# Altium schematic sheet Sensor_ExpandBoard_BH1750FV.SchDoc: Sensor Card
size A4; Revision: V1.1; SheetNumber: 6; SheetTotal: 7; Function: Ambient Light Sensor
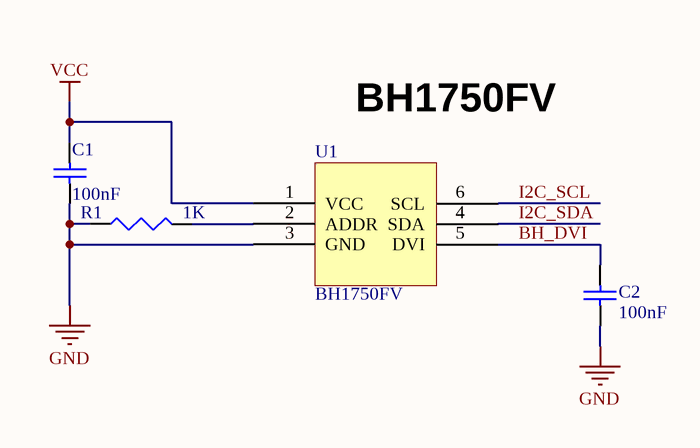
[diagram p0: Sensor_ExpandBoard_BH1750FV.SchDoc]

## Parts
C1  100nF  [0603-2]
C2  100nF  [0603-2]
R1  1K  [R0603]
U1  BH1750FV  [WSOF6]

## Nets
GND: C1.2 C2.2 R1.1 U1.3(GND)
VCC: C1.1 U1.1(VCC)
BH_DVI: C2.1 U1.5(DVI)
I2C_SCL: U1.6(SCL)
I2C_SDA: U1.4(SDA)
NetR1_2: R1.2 U1.2(ADDR)

## Notes on the sheet
- BH1750FV
- 工程名称：
- 图纸大小：
- 日期：
- A4
- 版本号：
- 页码：
- 第
- 共
- 制图：
- 审核：

## Library data of the parts
C1 C2 = Cap: 无极性电容; Published: 8-Jun-2000; LatestRevisionDate: 17-Jul-2002; LatestRevisionNote: Re-released for DXP Platform.; PackageReference: RAD-0.3; Publisher: Altium Limited; Value: 100nF
R1 = Res: Resistor; Published: 8-Jun-2000; LatestRevisionDate: 29-May-2009; LatestRevisionNote: IPC-7351 Footprint Added.; PackageReference: J1-0603; Publisher: Altium Limited; Value: 1K; PackageDescription: Chip Resistor
U1 = BH1750: 环境光传感器; Value: BH1750FV